# Altium schematic sheet ESP32.SchDoc
size A4
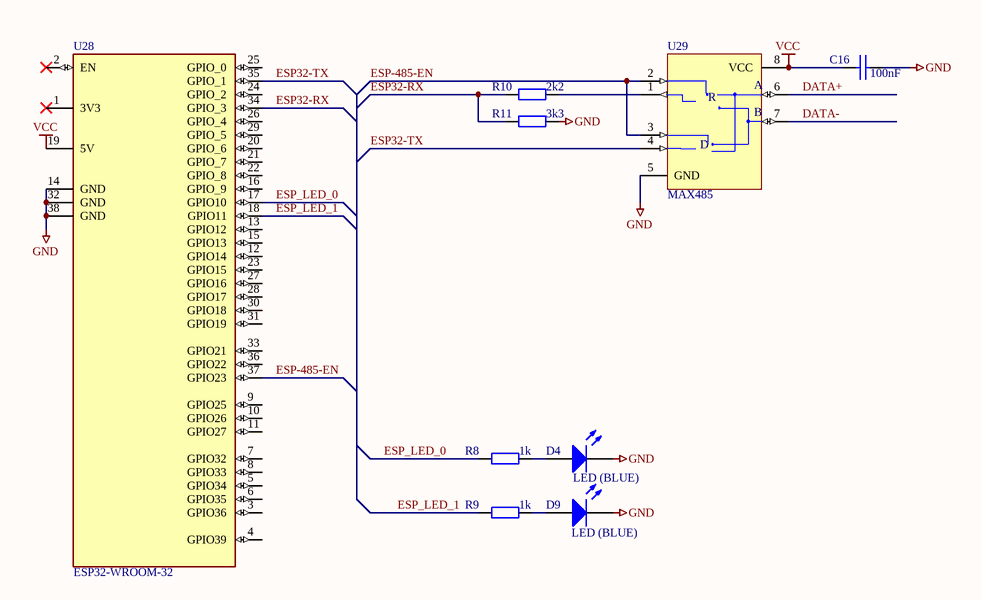
[diagram p0: ESP32.SchDoc]

## Parts
C16  100nF  [CAPACITOR 0805]
D4  LED (BLUE)  [LED(3D) 3MM VERTICAL (GREEN)]
D9  LED (BLUE)  [LED(3D) 3MM VERTICAL (GREEN)]
R8  1k  [RESISTOR 0805]
R9  1k  [RESISTOR 0805]
R10  2k2  [RESISTOR 0805]
R11  3k3  [RESISTOR 0805]
U28  ESP32-WROOM-32  [ESP-WROOM-32]
U29  MAX485  [SO-8]

## Nets
GND: C16.2 D4.2(K) D9.2(K) R11.1 U28.14(GND) U28.32(GND) U28.38(GND) U29.5(GND)
VCC: C16.1 U28.19(5V) U29.8(VCC)
DATA+: U29.6(A)
DATA-: U29.7(B)
ESP32-RX: R10.2 R11.2 U28.34(GPIO_3)
ESP32-TX: U28.35(GPIO_1) U29.4(DI)
ESP-485-EN: U28.37(GPIO23) U29.2(~{RE}) U29.3(DE)
ESP_LED_0: R8.2 U28.17(GPIO10)
ESP_LED_1: R9.2 U28.18(GPIO11)
NetD4_1: D4.1(A) R8.1
NetD9_1: D9.1(A) R9.1
NetR10_1: R10.1 U29.1(RO)

Not connected (* = marked no-connect by the designer): U28 1(3V3)* 2(EN)* 3(GPIO36) 4(GPIO39) 5(GPIO34) 6(GPIO35) 7(GPIO32) 8(GPIO33) 9(GPIO25) 10(GPIO26) 11(GPIO27) 12(GPIO14) 13(GPIO12) 15(GPIO13) 16(GPIO_9) 20(GPIO_6) 21(GPIO_7) 22(GPIO_8) 23(GPIO15) 24(GPIO_2) 25(GPIO_0) 26(GPIO_4) 27(GPIO16) 28(GPIO17) 29(GPIO_5) 30(GPIO18) 31(GPIO19) 33(GPIO21) 36(GPIO22)

## Notes on the sheet
- (in symbol MAX487CPA) R; D

## Library data of the parts
C16 = CAP: CAPACITOR SMD 0603; Manufacturer: Murata; Manufacturer Part No.: GCM188R71C104KA37D; value: 100nF; Mouser Part no.: 81-GCM188R71C104KA7D; Web link: http://au.mouser.com/ProductDetail/Murata/GCM188R71C104KA37D/?qs=aEuGZpxfbxWKAxwYn%252beTMg%3d%3d
D4 D9 = LED 3mm RED: 3mm RED LED; Manufacturer: Kingbright; Manufacturer Part No.: WP132XIT; Mouser Part no.: 604-WP132XIT; Farnell Part no.: 1003393; Web link: http://au.mouser.com/Search/Refine.aspx?Keyword=604-WP132XIT
R8-R11 = Res2: Resistor; Published: 8-Jun-2000; LatestRevisionDate: 17-Jul-2002; LatestRevisionNote: Re-released for DXP Platform.; PackageReference: AXIAL-0.4; Publisher: Altium Limited; PackageDescription: Axial Device, Thru-Hole; 2 Leads; 0.4 in Pin Spacing
  R8 R9: Value: 1k
  R10: Value: 2k2
  R11: Value: 3k3
U28 = ESP-WROOM-32 38 PIN Develeopment Board PINOUT
U29 = MAX487CPA: MAX485 485/422 Transceiver; LCSC Part Number: C9945